# Altium schematic sheet CANBUS.SchDoc
size A4
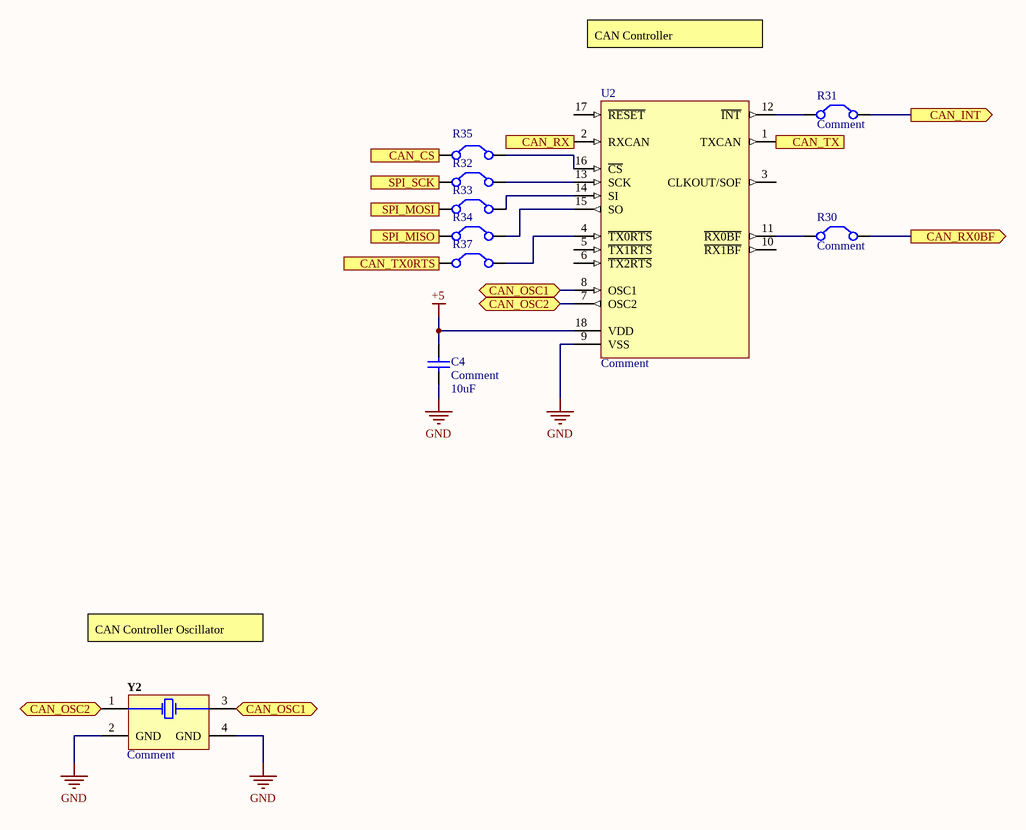
[diagram p0: CANBUS.SchDoc]

## Parts
C4  Comment  value 10uF  [J1-0603]
R30  Comment  [2012[0805]]
R31  Comment  [2012[0805]]
R32  Comment  [2012[0805]]  (value not drawn)
R33  Comment  [2012[0805]]  (value not drawn)
R34  Comment  [2012[0805]]  (value not drawn)
R35  Comment  [2012[0805]]  (value not drawn)
R37  Comment  [2012[0805]]  (value not drawn)
U2  Comment  [SOL-18_N]
Y2  Comment  [SOT223]

## Ports
CAN_CS (in), CAN_INT (out), CAN_OSC1 (bidir), CAN_OSC2 (bidir), CAN_RX0BF (out), CAN_RX (in), CAN_TX0RTS (in), CAN_TX (out), SPI_MISO (in), SPI_MOSI (in), SPI_SCK (in)

## Nets
+5: C4.2 U2.18(VDD)
GND: C4.2 U2.9(VSS) Y2.2(GND) Y2.4(GND)
CAN_CS: R35.1(C1) ; port CAN_CS
CAN_INT: R31.2(C2) ; port CAN_INT
CAN_OSC1: U2.8(OSC1) Y2.3(X2) ; port CAN_OSC1
CAN_OSC2: U2.7(OSC2) Y2.1(X1) ; port CAN_OSC2
CAN_RX: U2.2(RXCAN) ; port CAN_RX
CAN_RX0BF: R30.2(C2) ; port CAN_RX0BF
CAN_TX: U2.1(TXCAN) ; port CAN_TX
CAN_TX0RTS: R37.1(C1) ; port CAN_TX0RTS
SPI_MISO: R34.1(C1) ; port SPI_MISO
SPI_MOSI: R33.1(C1) ; port SPI_MOSI
SPI_SCK: R32.1(C1) ; port SPI_SCK
NetR30_1: R30.1(C1) U2.11(~{RX0BF})
NetR31_1: R31.1(C1) U2.12(~{INT})
NetR32_2: R32.2(C2) U2.13(SCK)
NetR33_2: R33.2(C2) U2.14(SI)
NetR34_2: R34.2(C2) U2.15(SO)
NetR35_2: R35.2(C2) U2.16(~{CS})
NetR37_2: R37.2(C2) U2.4(~{TX0RTS})

Not connected (* = marked no-connect by the designer): U2 3(CLKOUT/SOF) 5(~{TX1RTS}) 6(~{TX2RTS}) 10(~{RX1BF}) 17(~{RESET})

## Notes on the sheet
- CAN Controller
- CAN Controller Oscillator

## Library data of the parts
C4 = Cap Semi: Capacitor (Semiconductor SIM Model); Published: 8-Jun-2000; LatestRevisionDate: 29-May-2009; LatestRevisionNote: IPC-7351 Footprint Added.; PackageReference: C1206; Publisher: Altium Limited; PackageDescription: Chip Capacitor
R30-R35 R37 = Jumper: Jumper Wire; Published: 24-Mar-1999; LatestRevisionDate: 17-Jul-2002; LatestRevisionNote: Re-released for DXP Platform.; PackageReference: RAD-0.2; Publisher: Altium Limited; PackageDescription: Radial Cap, Thru-Hole; 2 Leads; 0.2 in Pin Spacing
U2 = CMP-0186-00133-2: Stand-Alone CAN Controller With SPI Interface, 18-Pin SOIC, Industrial Temperature; ComponentLink2Description: Datasheet; RevisionNote: URLs added. DatasheetVersion updated.; PackageVersion: revBB, Aug-2009; ComponentLink1URL: http://www.microchip.com/; PackageReference: SOIC-SO18; PackageDescription: 18-Lead Plastic Small Outline (SO) - Wide 7.50mm Body [SOIC]; DatasheetVersion: revF, Oct-2010; ComponentLink2URL: http://ww1.microchip.com/downloads/en/DeviceDoc/21801f.pdf; ComponentLink3URL: http://www.microchip.com/stellent/groups/techpub_sg/documents/packagingspec/en012702.pdf; Code_JEDEC: MS-013; ComponentLink3Description: Package Specification; ComponentLink1Description: Manufacturer URL
Y2 = CMP-2000-05693-1: SMD Seam Crystal, 20 MHz, +/- 10 ppm, 10 pF, -20 to 70 degC, 4-Pin SMD, RoHS, Tape and Reel; Manufacturer: TXC; Load Capacitance: 10pF; Operating Mode: Fundamental; Frequency Tolerance: ±10ppm; Frequency: 20MHz; Catalog Drawings: 7BSeriesTop / 7BSeriesBottom / 7BSeriesSide1 / 7BSeriesSide2 / 7BSeriesCircuit; ESR (Equivalent Series Resistance): 40Ohm; Other Names: 887-1303-1; Dynamic Catalog: 7BSeries; Category: CrystalsandOscillators; Datasheet Version: 02/2010; Type: MHzCrystal; Package / Case: 4-SMD,NoLead(DFN,LCC); Mounting Technology: SurfaceMount; Mounting Type: SurfaceMount; Package Description: 4-Pin Surface Mount Device, Body 5 x 3.2 mm, Pitch 3.7 mm; Packaging: CutTape(CT); Package Reference: 7B-4; Operating Temperature: -20°C~70°C; Series: 7B; Height: 0.041"(1.05mm); Manufacturer URL: http://www.txccorp.com/; Size / Dimension: 0.197"Lx0.126"W(5.00mmx3.20mm); Frequency Stability: ±10ppm; Standard Package: 1; Family: Crystals; Datasheet URL: http://www.txccrystal.com/images/pdf/7b-accuracy.pdf